# EAGLE design spi-interface (EAGLE 6.6.0)
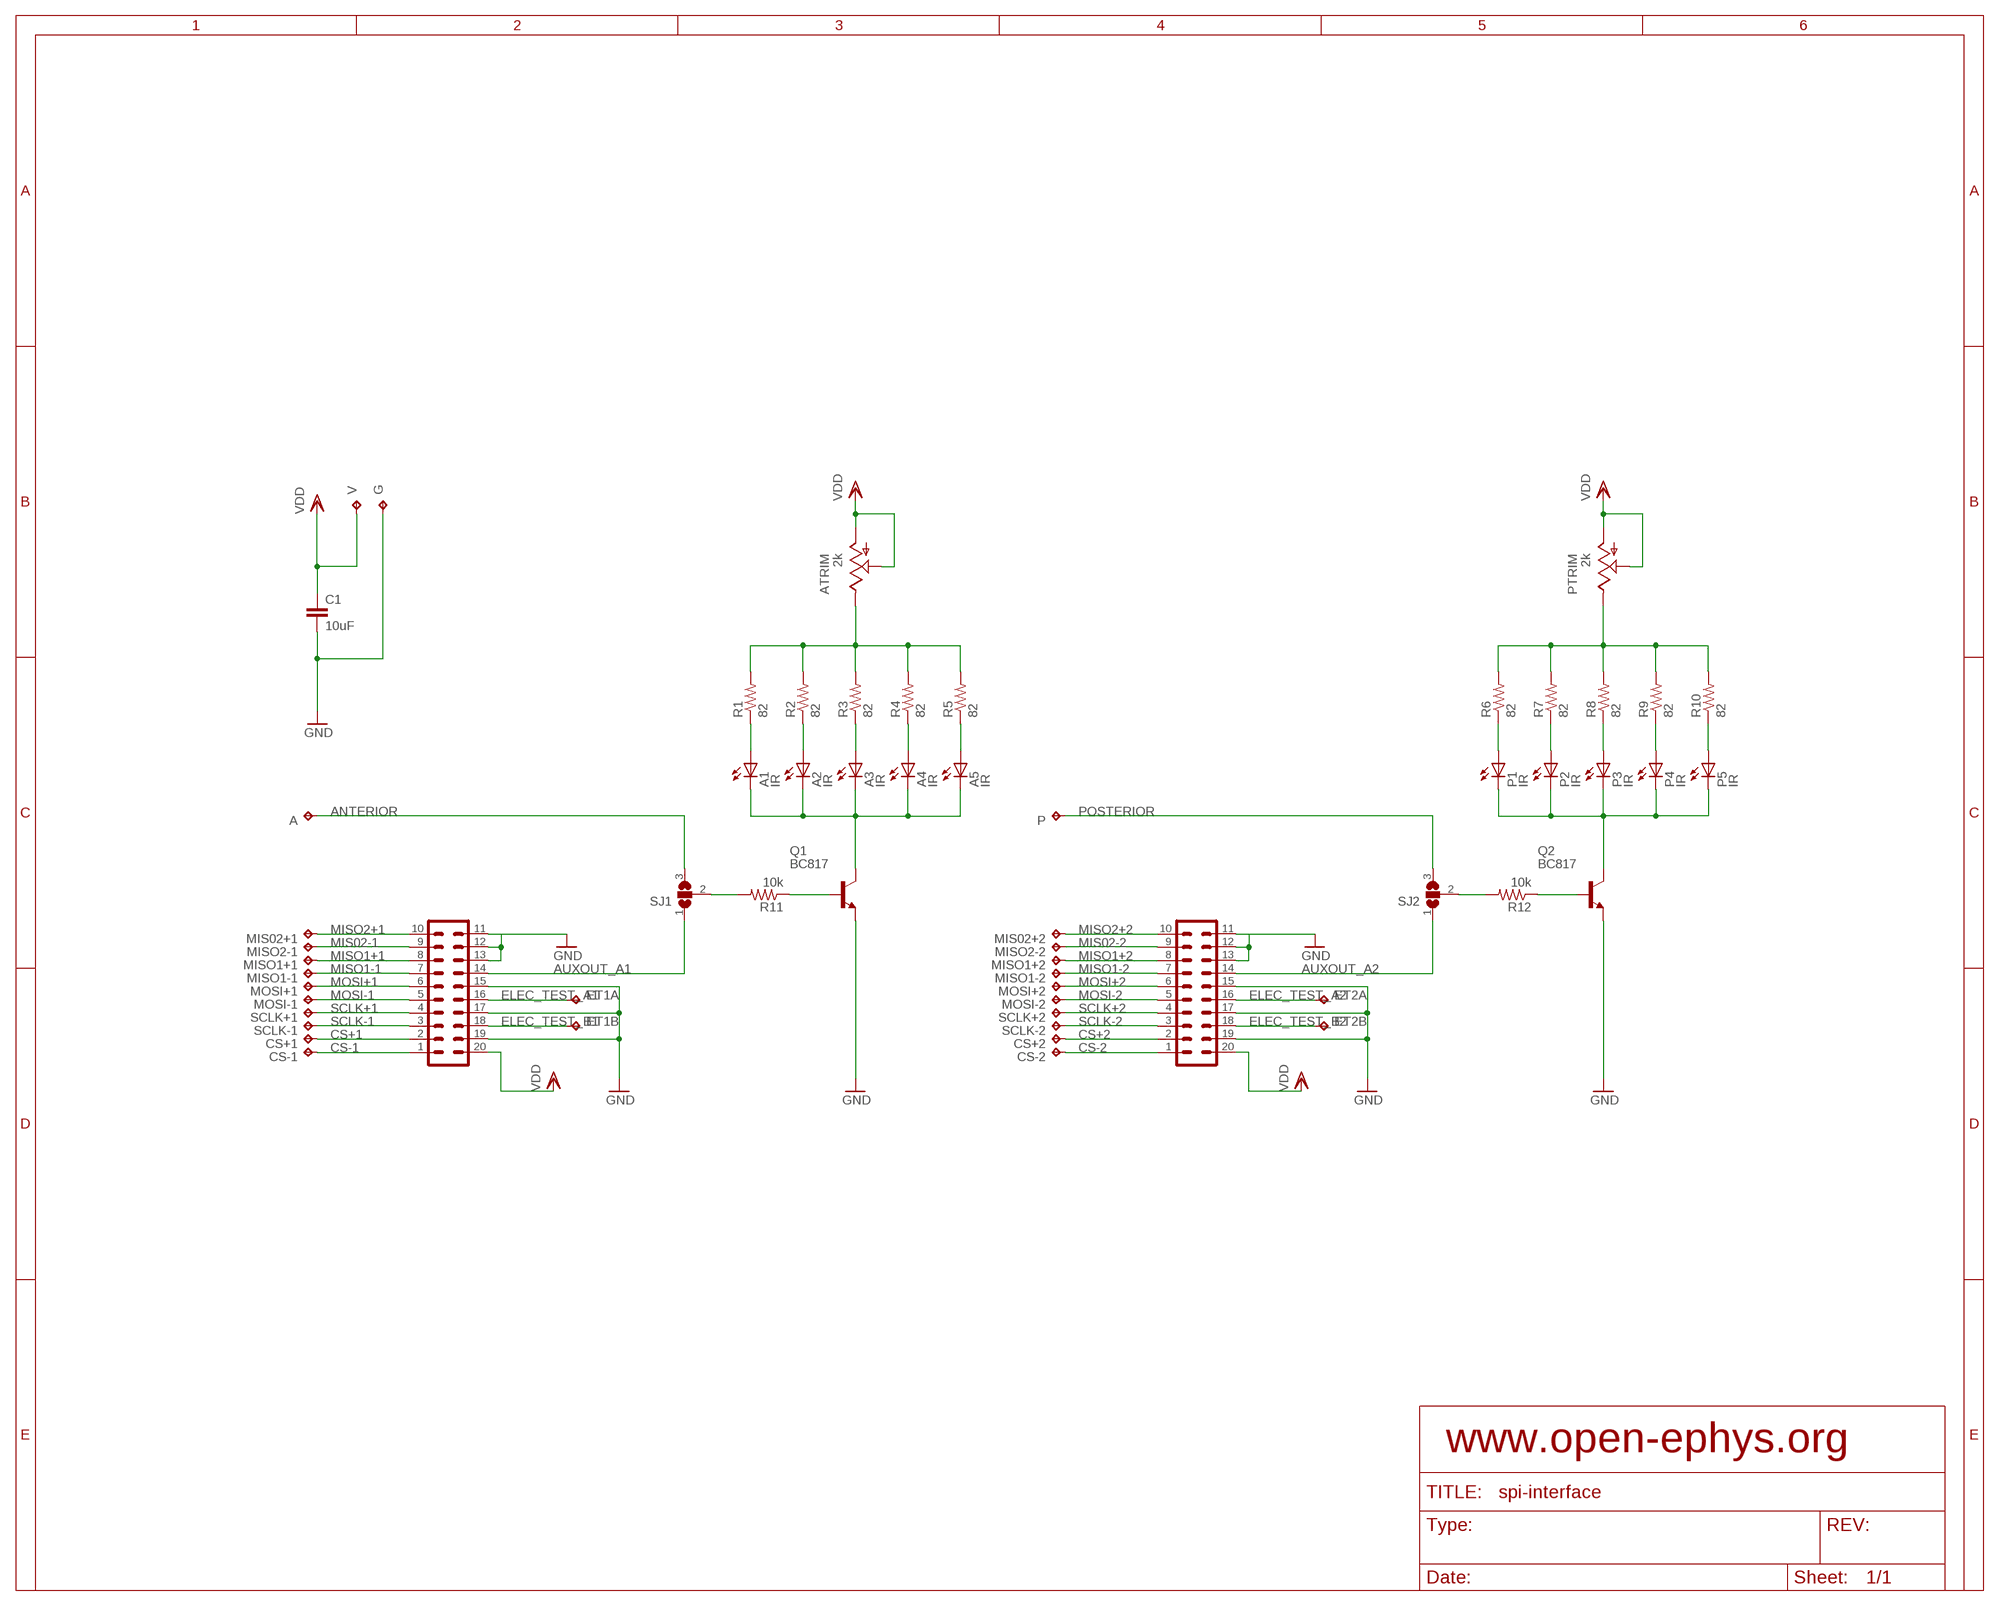
[diagram p0: schematic, sheet 1]

## Parts
A  TP_01  [TP01]
A1  IR  LED_0603  [LED-0603]
A2  IR  LED_0603  [LED-0603]
A3  IR  LED_0603  [LED-0603]
A4  IR  LED_0603  [LED-0603]
A5  IR  LED_0603  [LED-0603]
ATRIM  2k  TRIM_EIA/EIAJ  [EIA/EIAJ]
C1  10uF  C_0805  [0805]
CS+1  TP_01  [TP01]
CS+2  TP_01  [TP01]
CS-1  TP_01  [TP01]
CS-2  TP_01  [TP01]
ET1A  TP_03  [TP03]
ET1B  TP_03  [TP03]
ET2A  TP_03  [TP03]
ET2B  TP_03  [TP03]
G  TP_02  [TP02]
HS1  JMD20-V  PINHD-2X10_JMD20-V  [JMD20-V]
HS2  JMD20-V  PINHD-2X10_JMD20-V  [JMD20-V]
MIS02+1  TP_01  [TP01]
MIS02+2  TP_01  [TP01]
MISO1+1  TP_01  [TP01]
MISO1+2  TP_01  [TP01]
MISO1-1  TP_01  [TP01]
MISO1-2  TP_01  [TP01]
MISO2-1  TP_01  [TP01]
MISO2-2  TP_01  [TP01]
MOSI+1  TP_01  [TP01]
MOSI+2  TP_01  [TP01]
MOSI-1  TP_01  [TP01]
MOSI-2  TP_01  [TP01]
P  TP_01  [TP01]
P1  IR  LED_0603  [LED-0603]
P2  IR  LED_0603  [LED-0603]
P3  IR  LED_0603  [LED-0603]
P4  IR  LED_0603  [LED-0603]
P5  IR  LED_0603  [LED-0603]
PTRIM  2k  TRIM_EIA/EIAJ  [EIA/EIAJ]
Q1  BC817  BC817-16SMD  [SOT23-BEC]
Q2  BC817  BC817-16SMD  [SOT23-BEC]
R1  82  R_0402  [0402]
R2  82  R_0402  [0402]
R3  82  R_0402  [0402]
R4  82  R_0402  [0402]
R5  82  R_0402  [0402]
R6  82  R_0402  [0402]
R7  82  R_0402  [0402]
R8  82  R_0402  [0402]
R9  82  R_0402  [0402]
R10  82  R_0402  [0402]
R11  10k  R_0402  [0402]
R12  10k  R_0402  [0402]
SCLK+1  TP_01  [TP01]
SCLK+2  TP_01  [TP01]
SCLK-1  TP_01  [TP01]
SCLK-2  TP_01  [TP01]
SJ1  SJ2W  [SJ_2]
SJ2  SJ2W  [SJ_2]
V  TP_02  [TP02]

## Nets
ANTERIOR: A.TP SJ1.3
AUXOUT_A1: HS1.14 SJ1.1
AUXOUT_A2: HS2.14 SJ2.1
B2: P1.C P2.C P3.C P4.C P5.C Q2.C
CS+1: CS+1.TP HS1.2
CS+2: CS+2.TP HS2.2
CS-1: CS-1.TP HS1.1
CS-2: CS-2.TP HS2.1
ELEC_TEST_A1: ET1A.TP HS1.16
ELEC_TEST_A2: ET2A.TP HS2.16
ELEC_TEST_B1: ET1B.TP HS1.18
ELEC_TEST_B2: ET2B.TP HS2.18
F1: A1.C A2.C A3.C A4.C A5.C Q1.C
GND: C1.2 G.TP HS1.11 HS1.12 HS1.13 HS1.15 HS1.17 HS1.19 HS2.11 HS2.12 HS2.13 HS2.15 HS2.17 HS2.19 Q1.E Q2.E
MIS02-1: HS1.9 MISO2-1.TP
MIS02-2: HS2.9 MISO2-2.TP
MISO1+1: HS1.8 MISO1+1.TP
MISO1+2: HS2.8 MISO1+2.TP
MISO1-1: HS1.7 MISO1-1.TP
MISO1-2: HS2.7 MISO1-2.TP
MISO2+1: HS1.10 MIS02+1.TP
MISO2+2: HS2.10 MIS02+2.TP
MOSI+1: HS1.6 MOSI+1.TP
MOSI+2: HS2.6 MOSI+2.TP
MOSI-1: HS1.5 MOSI-1.TP
MOSI-2: HS2.5 MOSI-2.TP
N$1: ATRIM.E R1.2 R2.2 R3.2 R4.2 R5.2
N$2: P1.A R6.1
N$3: A1.A R1.1
N$4: R12.2 SJ2.2
N$5: Q2.B R12.1
N$6: PTRIM.E R6.2 R7.2 R8.2 R9.2 R10.2
N$8: A2.A R2.1
N$9: A3.A R3.1
N$10: A4.A R4.1
N$11: A5.A R5.1
N$12: P2.A R7.1
N$13: P3.A R8.1
N$14: P4.A R9.1
N$15: P5.A R10.1
N$28: Q1.B R11.1
N$34: R11.2 SJ1.2
POSTERIOR: P.TP SJ2.3
SCLK+1: HS1.4 SCLK+1.TP
SCLK+2: HS2.4 SCLK+2.TP
SCLK-1: HS1.3 SCLK-1.TP
SCLK-2: HS2.3 SCLK-2.TP
VDD: ATRIM.A ATRIM.S C1.1 HS1.20 HS2.20 PTRIM.A PTRIM.S V.TP

## Library data of the parts
A CS+1 CS+2 CS-1 CS-2 ET1A ET1B ET2A ET2B G MIS02+1 MIS02+2 MISO1+1 MISO1+2 MISO1-1 MISO1-2 MISO2-1 MISO2-2 MOSI+1 MOSI+2 MOSI-1 MOSI-2 P SCLK+1 SCLK+2 SCLK-1 SCLK-2 V = headstage:TP
A1-A5 P1-P5 = cyclops:LED: Surface mount LED
ATRIM PTRIM = headstage:TRIM
C1 = headstage:C: Capacitor; MN: TDK Corp.; PARTNO: C2012X5R1Cxxxxxxx; VID: DK
HS1 HS2 = headstage:PINHD-2X10
Q1 Q2 = cyclops:BC817*: NPN Transistor
R1-R12 = headstage:R: Resistor
SJ1 SJ2 = jumper:SJ2W: SMD solder JUMPER

## Board
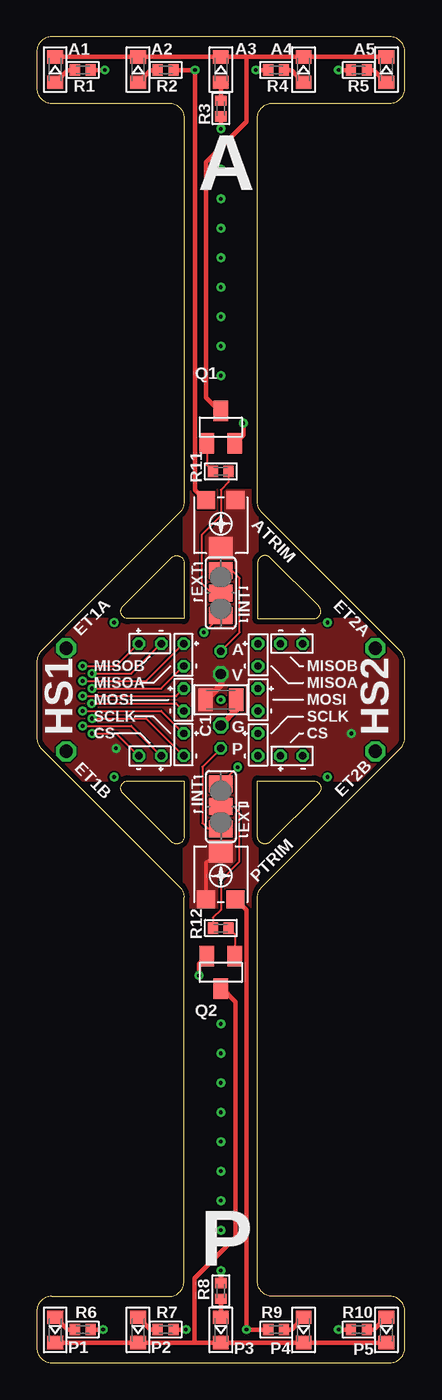
[diagram p1: board, top side]
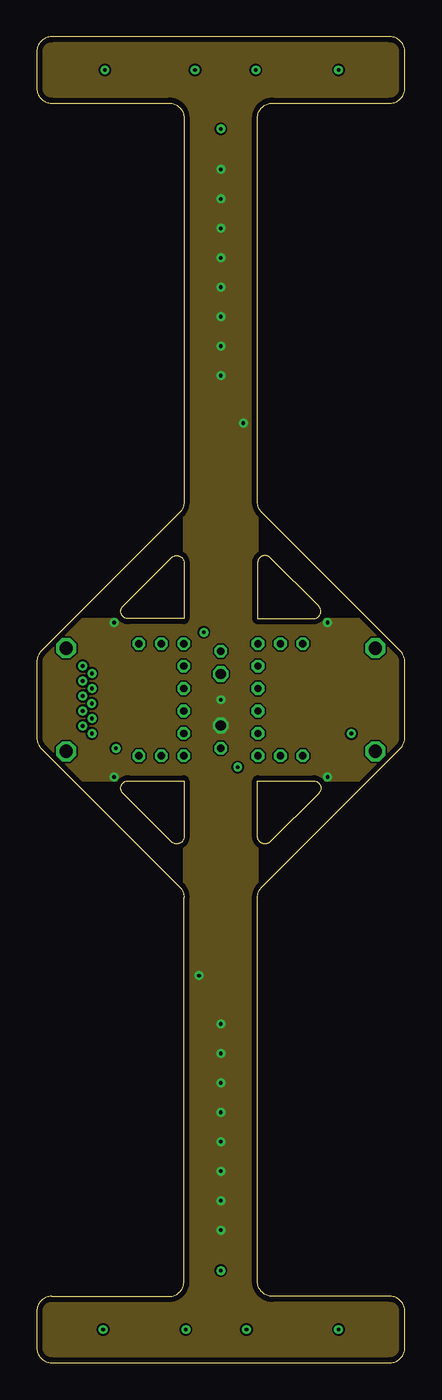
[diagram p2: board, inner layer Route2]
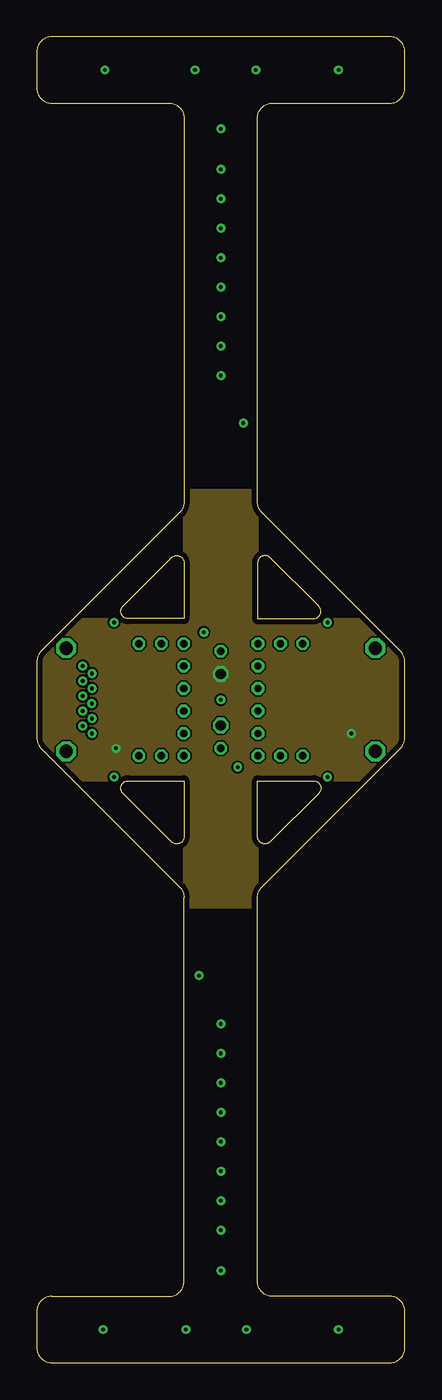
[diagram p3: board, inner layer Route15]
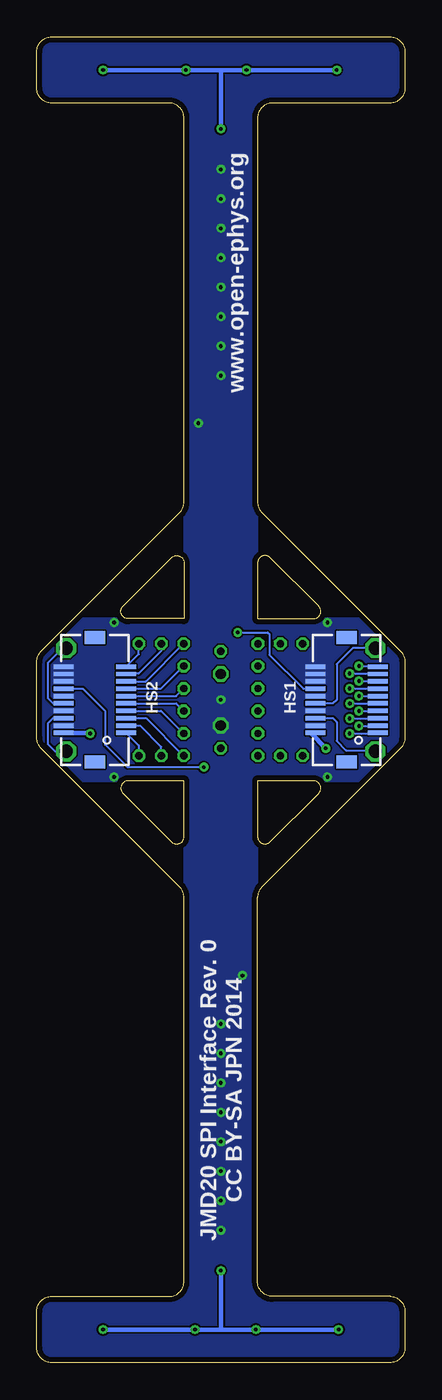
[diagram p4: board, bottom side, seen from below]

Size 25 x 90 mm. Coordinates in mm from the lower left corner, seen from the top.
Outline: 24,4.5 16,4.5 arc-90 15,5.5 15,31.59 arc-45 15.29,32.29 24.71,41.71 arc45 25,42.41 25,47.59 arc45 24.71,48.29 15.29,57.71 arc-45 15,58.41 15,84.5 arc-90 16,85.5 24,85.5 arc90 25,86.5 25,89 arc90 24,90 1,90 arc90 0,89 0,86.5 arc90 1,85.5 9,85.5 arc-90 10,84.5 10,58.41 arc-45 9.71,57.71 0.29,48.29 arc45 0,47.59 0,42.41 arc45 0.29,41.71 9.71,32.29 arc-45 10,31.59 10,5.5 arc-90 9,4.5 1,4.5 arc90 0,3.5 0,1 arc90 1,0 24,0 arc90 25,1 25,3.5 arc90 24,4.5
Outline: 10,50.5 6.21,50.5 arc-135 5.85,51.35 9.15,54.65 arc-135 10,54.29 10,50.5
Outline: 15,50.5 18.79,50.5 arc135 19.15,51.35 15.85,54.65 arc135 15,54.29 15,50.5
Outline: 10,39.5 10,35.71 arc-135 9.15,35.35 5.85,38.65 arc-135 6.21,39.5 10,39.5
Outline: 15,39.5 18.79,39.5 arc-135 19.15,38.65 15.85,35.35 arc-135 15,35.71 15,39.5
Copper layers (1+2*15+16): Top 0.0356mm / dielectric 1.5011mm / Route2 0.0356mm / dielectric 0.1499mm / Route15 0.0356mm / dielectric 0.2007mm / Bottom 0.0356mm
Design rules "ohs-park-4-layer": minimum track width 5mil, minimum drill 10mil, track to track 5mil, track to pad 5mil, pad to pad 5mil, via to via 5mil, smd to smd 5mil, copper to edge 15mil, drill to drill 5mil, minimum pad ring 7mil, minimum via ring 7mil, stop-mask expansion 4mil, vias tented up to drill 100mil, thermal gap 10mil

### Footprints (pad centres in the part's own frame; a part is rotated, then mirrored left to right if it is on the bottom)
TP01 = drill 0.5 octagon: TP 0,0
LED-0603 = smd 1.067 x 0.889: A 0,0.406; C 0,2.134
EIA/EIAJ = smd 1.2 x 1.2: A -1,-1.8; E 1,-1.8 | smd 1.6 x 1.5: S 0,1.45
0805 = smd 0.965 x 1.524: 1 -1.041,0; 2 1.041,0
TP03 = drill 0.9 octagon: TP 0,0
TP02 = drill 0.7 octagon: TP 0,0
JMD20-V = smd 0.3 x 1.35: 1 -2.25,-2.125; 2 -1.75,-2.125; 3 -1.25,-2.125; 4 -0.75,-2.125; 5 -0.25,-2.125; 6 0.25,-2.125; 7 0.75,-2.125; 8 1.25,-2.125; 9 1.75,-2.125; 10 2.25,-2.125; 11 2.25,2.125; 12 1.75,2.125; 13 1.25,2.125; 14 0.75,2.125; 15 0.25,2.125; 16 -0.25,2.125; 17 -0.75,2.125; 18 -1.25,2.125; 19 -1.75,2.125; 20 -2.25,2.125 | smd 0.85 x 1.4: MECH1 -4.225,0; MECH2 4.225,0
SOT23-BEC = smd 1 x 1.4: B -0.95,-1.1; C 0,1.1; E 0.95,-1.1
0402 = smd 0.686 x 0.762: 1 -0.533,0; 2 0.533,0
SJ_2 = smd 1.168 x 1.6: 1 -1.524,0; 2 0,0; 3 1.524,0

### Placement (x,y rotation side)
A  12.5,48.3 0 top
A1  1.25,86.5 0 top
A2  6.88,86.5 0 top
A3  12.5,86.5 0 top
A4  18.12,86.5 0 top
A5  23.75,86.5 0 top
ATRIM  12.5,56.75 180 top
C1  12.5,45 0 top
CS+1  8.45,41.19 0 top
CS+2  16.55,41.19 0 top
CS-1  6.93,41.19 0 top
CS-2  18.07,41.19 0 top
ET1A  2,48.5 0 top
ET1B  2,41.5 0 top
ET2A  23,48.5 0 top
ET2B  23,41.5 0 top
G  12.5,43.25 0 top
HS1  3.95,45 90 bottom
HS2  21.05,45 90 bottom
MIS02+1  6.93,48.81 0 top
MIS02+2  18.07,48.81 0 top
MISO1+1  9.98,48.81 0 top
MISO1+2  15.02,48.81 0 top
MISO1-1  9.98,47.29 0 top
MISO1-2  15.02,47.29 0 top
MISO2-1  8.45,48.81 0 top
MISO2-2  16.55,48.81 0 top
MOSI+1  9.98,45.76 0 top
MOSI+2  15.02,45.76 0 top
MOSI-1  9.98,44.24 0 top
MOSI-2  15.02,44.24 0 top
P  12.5,41.7 0 top
P1  1.25,3.5 180 top
P2  6.88,3.5 180 top
P3  12.5,3.5 180 top
P4  18.12,3.5 180 top
P5  23.75,3.5 180 top
PTRIM  12.5,33.25 0 top
Q1  12.5,63.5 0 top
Q2  12.5,26.5 180 top
R1  3.12,87.75 0 top
R2  8.75,87.75 0 top
R3  12.5,85.12 270 top
R4  16.25,87.75 180 top
R5  21.88,87.75 180 top
R6  3.12,2.25 0 top
R7  8.75,2.25 0 top
R8  12.5,4.88 90 top
R9  16.25,2.25 180 top
R10  21.88,2.25 180 top
R11  12.5,60.5 0 top
R12  12.5,29.5 180 top
SCLK+1  9.98,42.71 0 top
SCLK+2  15.02,42.71 0 top
SCLK-1  9.98,41.19 0 top
SCLK-2  15.02,41.19 0 top
SJ1  12.5,52.25 90 top
SJ2  12.5,37.75 270 top
V  12.5,46.75 0 top

### Tracks (layer width: path | path; a pad name or v marks a point on that pad's centre or on a via)
ANTERIOR
  Top 0.127: 12.61,53.27 SJ1.3 13.26,53.76 13.77,53.26 13.77,49.57 A.TP
AUXOUT_A1  (via drill 0.25)
  Top 0.127: v11.35,49.58 SJ1.1
  Bottom 0.127: v11.35,49.58 9.32,49.58 9.2,49.45 9.2,48.05 6.9,45.75 HS1.14
AUXOUT_A2  (via drill 0.25)
  Top 0.127: v13.65,40.42 SJ2.1
  Bottom 0.127: HS2.14 21.89,45.75 20.37,44.24 20.37,41.95 18.85,40.42 v13.65,40.42
B2
  Top 0.254: 12.2,25.4 Q2.C
  Top 0.305: 12.5,25.5 13.5,24.5 13.5,8.5 10.72,5.72 10.72,1.37 | P1.C P2.C 10.72,1.37 | P5.C P4.C P3.C 10.72,1.37
  Top 0.406: 12.5,25.5 Q2.C
CS+1  (via drill 0.25)
  Top 0.127: v3.11,43.22 6.42,43.22 CS+1.TP
  Bottom 0.127: v3.11,43.22 1.89,43.22 arc-45 HS1.2
CS+2
  Bottom 0.127: CS+2.TP 16.55,41.81 17.96,43.22 18.9,43.22 HS2.2
CS-1  (via drill 0.25)
  Top 0.127: v3.74,42.71 5.4,42.71 CS-1.TP
  Bottom 0.127: v3.74,42.71 1.91,42.71 arc-45 HS1.1
CS-2
  Bottom 0.127: HS2.1 18.07,41.9 CS-2.TP
ELEC_TEST_A1
  Bottom 0.127: ET1A.TP 3.54,48.5 4.63,47.41 4.63,45 4.88,44.75 HS1.16
ELEC_TEST_A2
  Bottom 0.127: ET2A.TP 23.25,48.5 24.25,47.5 24.25,45.1 23.9,44.75 HS2.16
ELEC_TEST_B1
  Bottom 0.127: HS1.18 4.9,43.75 4.63,43.48 4.63,42.21 3.99,41.57 2.07,41.57 ET1B.TP
ELEC_TEST_B2
  Bottom 0.127: HS2.18 23.9,43.75 24.25,43.4 24.25,42 23.75,41.5 ET2B.TP
F1
  Top 0.254: 14.25,88.61 14.28,88.63
  Top 0.305: 14.25,88.61 14.25,84.25 11.5,81.5 11.5,65.5 12.5,64.5 | A1.C A2.C A3.C 14.28,88.63 A4.C A5.C
  Top 0.406: Q1.C 12.5,64.5
GND  (via drill 0.25)
  Top 0.305: Q1.E 14.02,62.97 v14.02,63.78 | v11.02,26.28 11.02,27.07 Q2.E
  Top 0.406: C1.2 13.54,44.3 G.TP
  other vias: 12.5,21 12.5,19 12.5,17 12.5,15 12.5,13 12.5,11 12.5,23 12.5,69 12.5,71 12.5,73 12.5,75 12.5,77 12.5,79 12.5,67 12.5,9 12.5,81 5.25,39.75 19.75,50.25 5.25,50.25 19.75,39.75 12.5,45
  pour Bottom (no thermals): -0.5,90.5 25.5,90.5 25.5,83.5 15,83.5 15,50.5 25.5,50.5 25.5,39.5 15,39.5 15,6 25.5,6 25.5,-0.5 -0.5,-0.5 -0.5,6 10,6 10,39.5 -0.5,39.5 -0.5,50.5 10,50.5 10,83.5 -0.5,83.5
  pour Route2 (no thermals): -0.5,90.5 25.5,90.5 25.5,83.5 15,83.5 15,50.5 25.5,50.5 25.5,39.5 15,39.5 15,6 25.5,6 25.5,-0.5 -0.5,-0.5 -0.5,6 10,6 10,39.5 -0.5,39.5 -0.5,50.5 10,50.5 10,83.5 -0.5,83.5
MIS02-1  (via drill 0.25)
  Top 0.127: v3.74,46.78 6.42,46.78 MISO2-1.TP
  Bottom 0.127: v3.74,46.78 1.89,46.78 arc45 HS1.9
MIS02-2
  Bottom 0.127: MISO2-2.TP 16.55,48.32 18.09,46.78 18.9,46.78 HS2.9
MISO1+1  (via drill 0.25)
  Top 0.127: v3.11,46.27 7.44,46.27 MISO1+1.TP
  Bottom 0.127: v3.11,46.27 1.87,46.27 arc45 HS1.8
MISO1+2
  Bottom 0.127: HS2.8 17.58,46.25 MISO1+2.TP
MISO1-1  (via drill 0.25)
  Top 0.127: v3.74,45.76 8.45,45.76 MISO1-1.TP
  Bottom 0.127: v3.74,45.76 v3.73,45.75 HS1.7
MISO1-2
  Bottom 0.127: HS2.7 16.56,45.75 MISO1-2.TP
MISO2+1  (via drill 0.25)
  Top 0.127: v3.11,47.29 5.4,47.29 MIS02+1.TP
  Bottom 0.127: v3.11,47.29 1.91,47.29 arc45 HS1.10
MISO2+2
  Bottom 0.127: HS2.10 18.07,48.1 MIS02+2.TP
MOSI+1  (via drill 0.25)
  Top 0.127: v3.11,45.25 9.47,45.25 MOSI+1.TP
  Bottom 0.127: v3.11,45.25 1.84,45.25 arc45 HS1.6
MOSI+2
  Bottom 0.127: HS2.6 15.54,45.25 MOSI+2.TP
MOSI-1  (via drill 0.25)
  Top 0.127: v3.74,44.75 9.46,44.75 MOSI-1.TP
  Bottom 0.127: v3.74,44.75 HS1.5
MOSI-2
  Bottom 0.127: HS2.5 15.54,44.75 MOSI-2.TP
N$1  (via drill 0.25)
  Top 0.254: 11.5,58.5 ATRIM.E | 10.72,87.67 10.75,87.67 v10.75,87.75
  Top 0.305: 11.5,58.5 10.75,59.25 10.75,87.67 | R2.2 v10.75,87.75 | v4.62,87.75 R1.2 | v20.5,87.75 R5.2 | R4.2 v14.88,87.75 | R3.2 v12.5,83.75
  Bottom 0.254: 10.75,87.67 v10.75,87.75
  Bottom 0.305: v4.62,87.75 v10.75,87.75 12.5,87.75 | 12.5,87.75 v14.88,87.75 v20.5,87.75 | v12.5,83.75 12.5,87.75
N$2
  Top 0.305: R6.1 2.09,2.25 P1.A
N$3
  Top 0.305: A1.A 2.09,87.75 R1.1
N$4
  Top 0.127: R12.2 11.97,30.22 12.5,30.75 12.5,32.75 13.75,34 13.75,37.38 13.38,37.75 SJ2.2
N$5
  Top 0.127: R12.1 13.45,29.08 Q2.B
N$6  (via drill 0.25)
  Top 0.254: PTRIM.E 13.55,31.45
  Top 0.305: 13.55,31.45 14.25,30.75 v14.25,2.25 R9.2 | R6.2 v4.5,2.25 | R7.2 v10.12,2.25 | R10.2 v20.5,2.25 | R8.2 v12.5,6.25
  Bottom 0.305: v20.5,2.25 v14.25,2.25 12.5,2.25 | 12.5,2.25 v10.12,2.25 v4.5,2.25 | v12.5,6.25 12.5,2.25
N$8
  Top 0.305: A2.A 7.72,87.75 R2.1
N$9
  Top 0.305: R3.1 A3.A
N$10
  Top 0.305: A4.A 17.28,87.75 R4.1
N$11
  Top 0.305: A5.A 22.91,87.75 R5.1
N$12
  Top 0.305: R7.1 7.72,2.25 P2.A
N$13
  Top 0.305: R8.1 P3.A
N$14
  Top 0.305: R9.1 17.28,2.25 P4.A
N$15
  Top 0.305: R10.1 22.91,2.25 P5.A
N$28
  Top 0.127: Q1.B 11.55,60.92 R11.1
N$34
  Top 0.127: R11.2 13.03,59.78 12.5,59.25 12.5,57.5 11.23,56.23 11.23,52.87 11.85,52.25 SJ1.2
POSTERIOR
  Top 0.127: 12.5,36.75 13.26,36.75 SJ2.3 12.48,36.25 11.62,36.25 11.25,36.62 11.25,40.45 P.TP
SCLK+1  (via drill 0.25)
  Top 0.127: v3.11,44.24 8.45,44.24 SCLK+1.TP
  Bottom 0.127: v3.11,44.24 1.85,44.24 arc-45 HS1.4
SCLK+2
  Bottom 0.127: HS2.4 16.56,44.25 SCLK+2.TP
SCLK-1  (via drill 0.25)
  Top 0.127: v3.74,43.73 7.44,43.73 SCLK-1.TP
  Bottom 0.127: v3.74,43.73 1.87,43.73 arc-45 HS1.3
SCLK-2
  Bottom 0.127: HS2.3 17.58,43.75 SCLK-2.TP
VDD  (via drill 0.25)
  Top 0.254: PTRIM.S 11.5,33.95 PTRIM.A
  Top 0.406: V.TP 12.5,46 11.5,45
  Bottom 0.305: HS1.20 6.38,42.75 v5.38,41.7 | HS2.20 21.42,42.75 v21.38,42.7
  pour Top (no thermals): -0.37,42.61 -0.5,50.5 10,50.5 10,59.26 15,59.26 15,50.5 25.5,50.5 25.62,39.5 15,39.5 15,30.86 10,30.86 10,39.5 -0.38,39.5 -0.38,40.38
  pour Route15 (no thermals): -0.37,42.61 -0.5,50.5 10,50.5 10,59.26 15,59.26 15,50.5 25.5,50.5 25.62,39.5 15,39.5 15,30.86 10,30.86 10,39.5 -0.38,39.5 -0.38,40.38

### Text on the board
tPlace: A | EXT | INT | MISOB | MISOB | MISOA | MISOA | HS1 | MOSI | MOSI | HS2 | SCLK | SCLK | CS | CS | INT | EXT | P
bPlace: www.open-ephys.org | JMD20 SPI Interface Rev. 0 / CC BY-SA JPN 2014